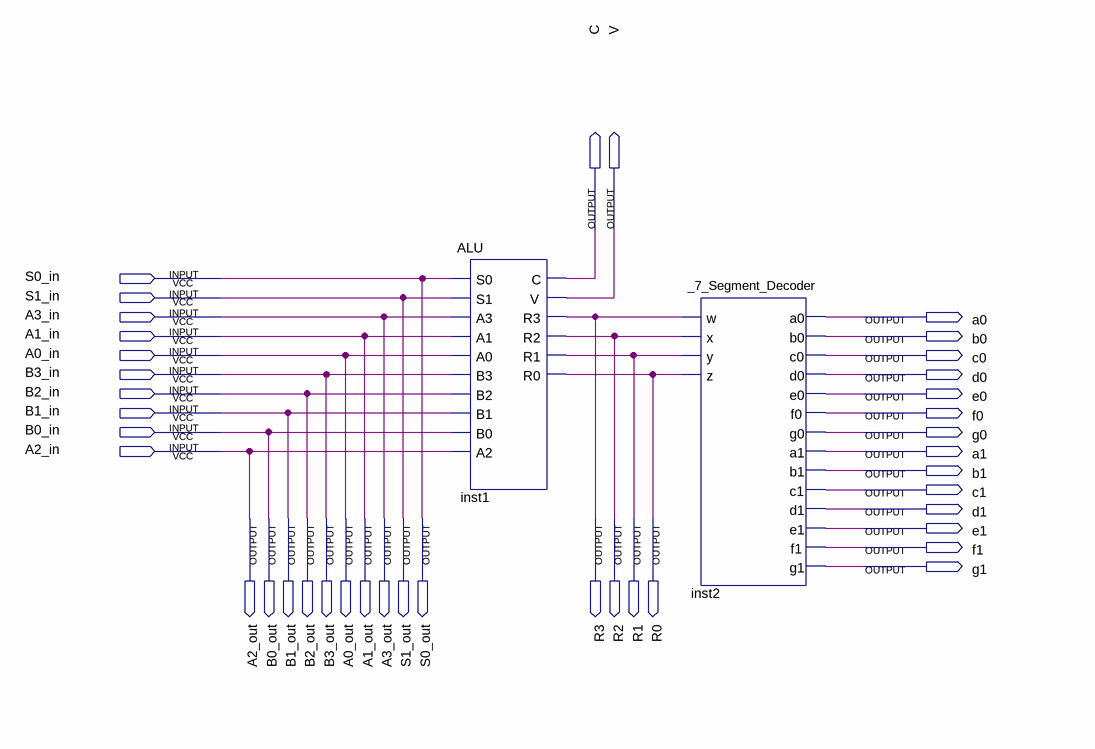
[diagram p0: schematic sheet]
// Quartus schematic ALU_Tester.bdf as structural Verilog: 2 symbols, 40 pins
module ALU_Tester (
  input  S0_in,
  input  S1_in,
  input  A3_in,
  input  A1_in,
  input  A0_in,
  input  B3_in,
  input  B2_in,
  input  B1_in,
  input  B0_in,
  input  A2_in,
  output C,
  output V,
  output a0,
  output b0,
  output c0,
  output d0,
  output e0,
  output f0,
  output g0,
  output a1,
  output b1,
  output c1,
  output d1,
  output A2_out,
  output B0_out,
  output B1_out,
  output B2_out,
  output B3_out,
  output A0_out,
  output A1_out,
  output A3_out,
  output S1_out,
  output S0_out,
  output R3,
  output R2,
  output R1,
  output R0,
  output e1,
  output f1,
  output g1
);

  ALU inst1 (
    .S0(S0_in), .S1(S1_in), .A3(A3_in), .A1(A1_in), .A0(A0_in), .B3(B3_in), .B2(B2_in), .B1(B1_in),
    .B0(B0_in), .A2(A2_in), .C(C), .V(V), .R3(R3), .R2(R2), .R1(R1), .R0(R0));
  _7_Segment_Decoder inst2 (
    .w(R3), .x(R2), .y(R1), .z(R0), .a0(a0), .b0(b0), .c0(c0), .d0(d0), .e0(e0), .f0(f0), .g0(g0), .a1(a1),
    .b1(b1), .c1(c1), .d1(d1), .e1(e1), .f1(f1), .g1(g1));

  assign A0_out = A0_in;
  assign A1_out = A1_in;
  assign A2_out = A2_in;
  assign A3_out = A3_in;
  assign B0_out = B0_in;
  assign B1_out = B1_in;
  assign B2_out = B2_in;
  assign B3_out = B3_in;
  assign S0_out = S0_in;
  assign S1_out = S1_in;
endmodule
